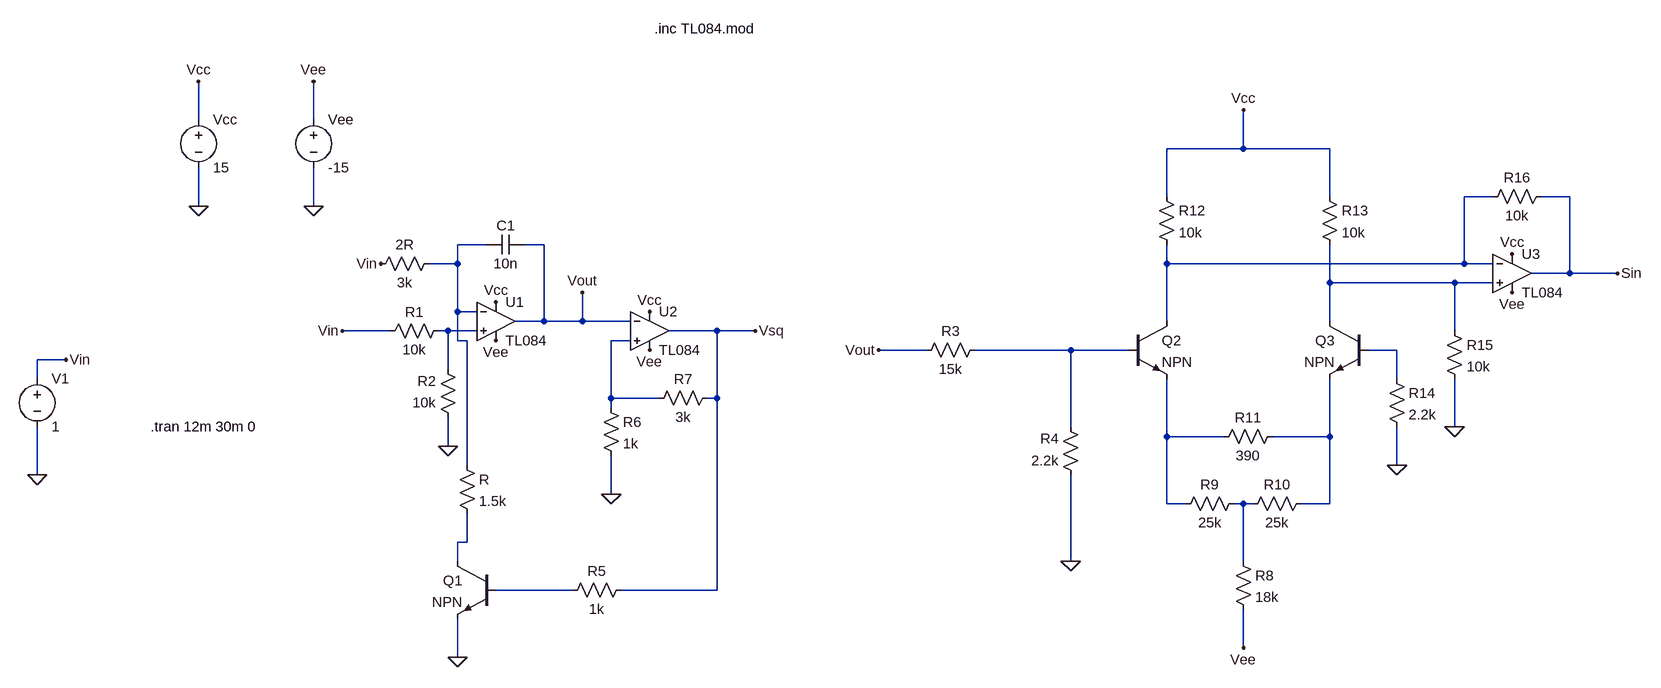
[diagram p0: schematic Sim1.asc]
Sim1.asc, the LTspice schematic file:
Version 4
SHEET 1 2352 1360
WIRE -432 288 -432 224
WIRE -240 288 -240 224
WIRE 1680 336 1680 272
WIRE 1680 336 1552 336
WIRE 1824 336 1680 336
WIRE 1552 416 1552 336
WIRE 1824 416 1824 336
WIRE 2096 416 2048 416
WIRE 2224 416 2176 416
WIRE -432 432 -432 368
WIRE -240 432 -240 368
WIRE 48 496 0 496
WIRE 144 496 112 496
WIRE 0 528 0 496
WIRE 0 528 -48 528
WIRE 1552 528 1552 496
WIRE 2048 528 2048 416
WIRE 2048 528 1552 528
WIRE 2096 528 2048 528
WIRE 2224 544 2224 416
WIRE 2224 544 2160 544
WIRE 2304 544 2224 544
WIRE 1824 560 1824 496
WIRE 2032 560 1824 560
WIRE 2096 560 2032 560
WIRE 0 608 0 528
WIRE 32 608 0 608
WIRE 144 624 144 496
WIRE 144 624 96 624
WIRE 208 624 208 576
WIRE 208 624 144 624
WIRE 288 624 208 624
WIRE 1552 624 1552 528
WIRE 1824 624 1824 560
WIRE -112 640 -192 640
WIRE -16 640 -32 640
WIRE 32 640 -16 640
WIRE 432 640 352 640
WIRE 496 640 432 640
WIRE 2032 640 2032 560
WIRE 0 656 0 608
WIRE 16 656 0 656
WIRE 288 656 256 656
WIRE 1152 672 1072 672
WIRE 1392 672 1232 672
WIRE 1488 672 1392 672
WIRE 1936 672 1888 672
WIRE -928 688 -976 688
WIRE -16 704 -16 640
WIRE -976 720 -976 688
WIRE 1936 720 1936 672
WIRE 256 752 256 656
WIRE 336 752 256 752
WIRE 432 752 432 640
WIRE 432 752 416 752
WIRE 256 768 256 752
WIRE 1392 800 1392 672
WIRE 2032 800 2032 720
WIRE 1552 816 1552 720
WIRE 1648 816 1552 816
WIRE 1824 816 1824 720
WIRE 1824 816 1728 816
WIRE -16 832 -16 784
WIRE 16 864 16 656
WIRE 1936 864 1936 800
WIRE -976 880 -976 800
WIRE 256 912 256 848
WIRE 1552 928 1552 816
WIRE 1584 928 1552 928
WIRE 1680 928 1664 928
WIRE 1696 928 1680 928
WIRE 1824 928 1824 816
WIRE 1824 928 1776 928
WIRE 16 992 16 944
WIRE 16 992 0 992
WIRE 0 1024 0 992
WIRE 1392 1024 1392 880
WIRE 1680 1024 1680 928
WIRE 192 1072 64 1072
WIRE 432 1072 432 752
WIRE 432 1072 272 1072
WIRE 1680 1168 1680 1104
WIRE 0 1184 0 1120
FLAG -976 880 0
FLAG -432 224 Vcc
FLAG -240 224 Vee
FLAG -240 432 0
FLAG -432 432 0
FLAG -928 688 Vin
FLAG 64 592 Vcc
FLAG 320 608 Vcc
FLAG 64 656 Vee
FLAG 320 672 Vee
FLAG -128 528 Vin
FLAG -192 640 Vin
FLAG -16 832 0
FLAG 256 912 0
FLAG 208 576 Vout
FLAG 496 640 Vsq
FLAG 0 1184 0
FLAG 1680 1168 Vee
FLAG 1936 864 0
FLAG 1392 1024 0
FLAG 1680 272 Vcc
FLAG 2128 512 Vcc
FLAG 2128 576 Vee
FLAG 2032 800 0
FLAG 2304 544 Sin
FLAG 1072 672 Vout
SYMBOL voltage -976 704 R0
SYMATTR InstName V1
SYMATTR Value 1
SYMBOL voltage -432 272 R0
SYMATTR InstName Vcc
SYMATTR Value 15
SYMBOL voltage -240 272 R0
SYMATTR InstName Vee
SYMATTR Value -15
SYMBOL Opamps/opamp2 64 560 R0
SYMATTR InstName U1
SYMATTR Value TL084
SYMBOL res -16 624 R90
WINDOW 0 0 56 VBottom 2
WINDOW 3 32 56 VTop 2
SYMATTR InstName R1
SYMATTR Value 10k
SYMBOL res 0 800 R180
WINDOW 0 36 76 Left 2
WINDOW 3 36 40 Left 2
SYMATTR InstName R2
SYMATTR Value 10k
SYMBOL res -144 544 R270
WINDOW 0 32 56 VTop 2
WINDOW 3 0 56 VBottom 2
SYMATTR InstName 2R
SYMATTR Value 3k
SYMBOL res 0 848 R0
SYMATTR InstName R
SYMATTR Value 1.5k
SYMBOL res 288 1056 R90
WINDOW 0 0 56 VBottom 2
WINDOW 3 32 56 VTop 2
SYMATTR InstName R5
SYMATTR Value 1k
SYMBOL cap 112 480 R90
WINDOW 0 0 32 VBottom 2
WINDOW 3 32 32 VTop 2
SYMATTR InstName C1
SYMATTR Value 10n
SYMBOL Opamps/opamp2 320 576 R0
SYMATTR InstName U2
SYMATTR Value TL084
SYMBOL res 240 752 R0
SYMATTR InstName R6
SYMATTR Value 1k
SYMBOL res 432 736 R90
WINDOW 0 0 56 VBottom 2
WINDOW 3 32 56 VTop 2
SYMATTR InstName R7
SYMATTR Value 3k
SYMBOL npn 64 1024 M0
SYMATTR InstName Q1
SYMBOL res 1248 656 R90
WINDOW 0 0 56 VBottom 2
WINDOW 3 32 56 VTop 2
SYMATTR InstName R3
SYMATTR Value 15k
SYMBOL res 1408 896 R180
WINDOW 0 36 76 Left 2
WINDOW 3 36 40 Left 2
SYMATTR InstName R4
SYMATTR Value 2.2k
SYMBOL npn 1488 624 R0
SYMATTR InstName Q2
SYMBOL res 1744 800 R90
WINDOW 0 0 56 VBottom 2
WINDOW 3 32 56 VTop 2
SYMATTR InstName R11
SYMATTR Value 390
SYMBOL npn 1888 624 M0
SYMATTR InstName Q3
SYMBOL res 1536 400 R0
SYMATTR InstName R12
SYMATTR Value 10k
SYMBOL res 1808 400 R0
SYMATTR InstName R13
SYMATTR Value 10k
SYMBOL res 1920 704 R0
SYMATTR InstName R14
SYMATTR Value 2.2k
SYMBOL res 1664 1008 R0
SYMATTR InstName R8
SYMATTR Value 18k
SYMBOL res 1680 912 R90
WINDOW 0 0 56 VBottom 2
WINDOW 3 32 56 VTop 2
SYMATTR InstName R9
SYMATTR Value 25k
SYMBOL res 1792 912 R90
WINDOW 0 0 56 VBottom 2
WINDOW 3 32 56 VTop 2
SYMATTR InstName R10
SYMATTR Value 25k
SYMBOL Opamps/opamp2 2128 480 R0
SYMATTR InstName U3
SYMATTR Value TL084
SYMBOL res 2016 624 R0
SYMATTR InstName R15
SYMATTR Value 10k
SYMBOL res 2192 400 R90
WINDOW 0 0 56 VBottom 2
WINDOW 3 32 56 VTop 2
SYMATTR InstName R16
SYMATTR Value 10k
TEXT 328 136 Left 2 !.inc TL084.mod
TEXT -512 800 Left 2 !.tran 12m 30m 0

The netlist it stands for:
* Sim1.asc
V1 Vin 0 1
Vcc Vcc 0 15
Vee Vee 0 -15
XU1 N004 N002 Vcc Vee Vout TL084  ; pins In+ In- V+ V- OUT
R1 N004 Vin 10k
R2 0 N004 10k
R§2R Vin N002 3k
R N002 N011 1.5k
R5 Vsq N012 1k
C1 Vout N002 10n
XU2 N005 Vout Vcc Vee Vsq TL084  ; pins In+ In- V+ V- OUT
R6 N005 0 1k
R7 Vsq N005 3k
Q1 N011 N012 0 0 NPN
R3 N006 Vout 15k
R4 0 N006 2.2k
Q2 N001 N006 N008 0 NPN
R11 N009 N008 390
Q3 N003 N007 N009 0 NPN
R12 Vcc N001 10k
R13 Vcc N003 10k
R14 N007 0 2.2k
R8 N010 Vee 18k
R9 N010 N008 25k
R10 N009 N010 25k
XU3 N003 N001 Vcc Vee Sin TL084  ; pins In+ In- V+ V- OUT
R15 N003 0 10k
R16 Sin N001 10k
.model NPN NPN
.model PNP PNP
.lib standard.bjt
.inc TL084.mod
.tran 12m 30m 0
.backanno
.end